# Altium schematic sheet UPS.SchDoc
size A; SheetNumber: 1; SheetTotal: 2
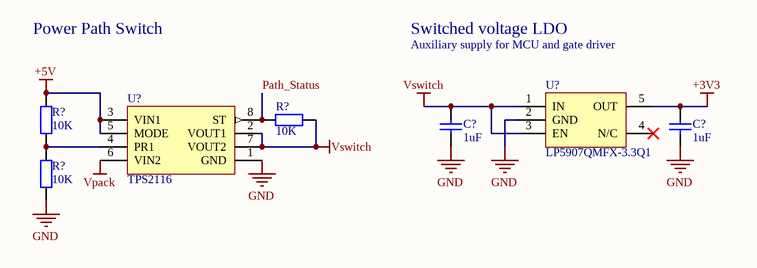
[diagram p0: UPS.SchDoc]

## Parts
(Parts that share a designator on the sheet are numbered #1, #2 ... from top to bottom, then left to right.)
C?#1  1uF  [Model Name]
C?#2  1uF  [Model Name]
R?#1  10K
R?#2  10K
R?#3  10K
U?#1  LP5907QMFX-3.3Q1  [SOT23-5]
U?#2  TPS2116  [SOTFL50P160X60-8N]

## Nets
+3V3: C?#2.2 U?#1.5(OUT)
+5V: R?#1.2 U?#2.3(VIN1) U?#2.5(MODE)
GND: C?#1.1 C?#2.1 R?#3.1 U?#1.2(GND) U?#2.1(GND)
Vpack: U?#2.6(VIN2)
Vswitch: C?#1.2 R?#2.1 U?#1.1(IN) U?#1.3(EN) U?#2.2(VOUT1) U?#2.7(VOUT2)
Path_Status: R?#2.2 U?#2.8(ST)
NetR?#1_1: R?#1.1 R?#3.2 U?#2.4(PR1)

Not connected (* = marked no-connect by the designer): U?#1 4(N/C)*

## Notes on the sheet
- Power Path Switch
- Switched voltage LDO
- Auxiliary supply for MCU and gate driver

## Library data of the parts
C?#1 C?#2 = 1uF: Capacitor; Voltage: *; Value: 1uF
R?#1-R?#3 = 10K: Resistor; Value: 10K
U?#1 = LP5907QMFX-3.3Q1: Integrated Circuit; Manufacturer_Name: Texas Instruments; Datasheet Link: http://www.ti.com/lit/gpn/lp5907-q1; Height: 1.45mm; Manufacturer_Part_Number: LP5907QMFX-3.3Q1; Mouser Part Number: 595-LP5907QMFX-3.3Q1; Mouser Price/Stock: https://www.mouser.co.uk/ProductDetail/Texas-Instruments/LP5907QMFX-3.3Q1?qs=asCBFxFfL1RsL2VYqGFsBQ%3D%3D; Arrow Part Number: LP5907QMFX-3.3Q1; Arrow Price/Stock: https://www.arrow.com/en/products/lp5907qmfx-3.3q1/texas-instruments